# EasyEDA schematic FSPDL_50.5-51Hz.json
TITLE: FSPC for SSR; REV: 1.0; Date: 2021-05-08; Sheet: 1/1; Company: John Matthew Lynch
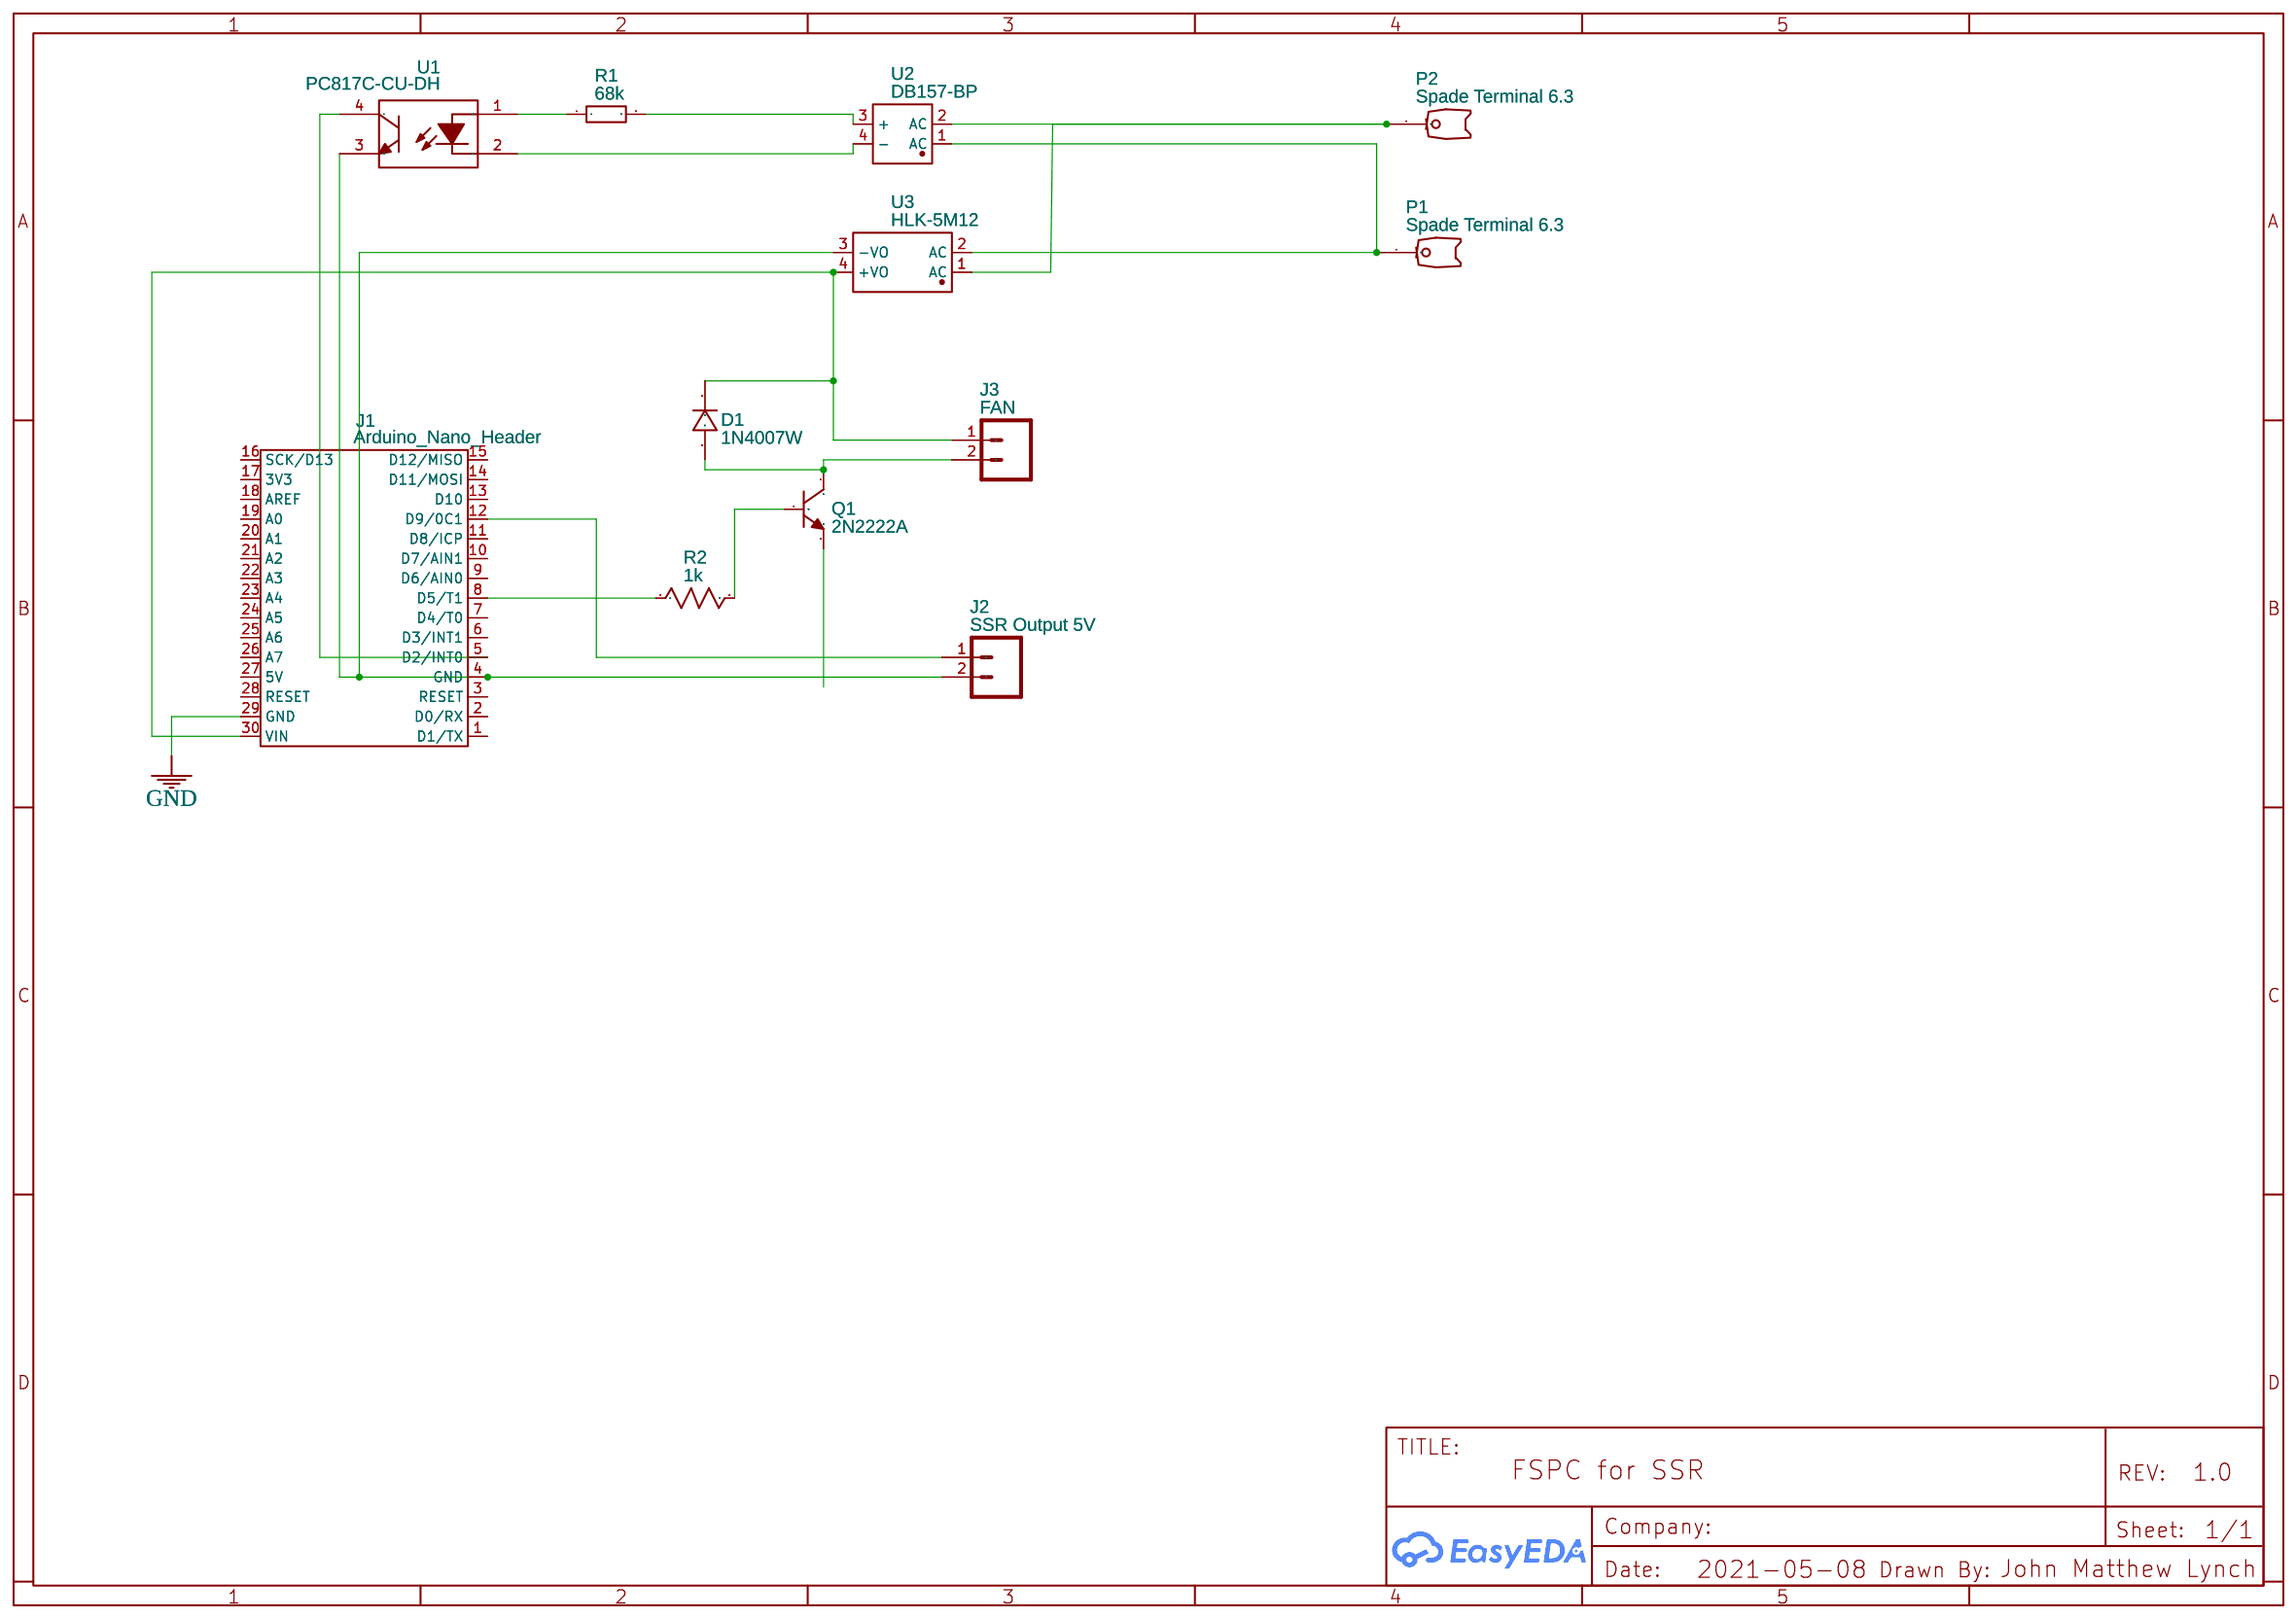
[diagram p0: schematic sheet]

## Parts
D1  1N4007W  [SOD-123_L2.8-W1.8-LS3.7-RD]
J1  Arduino_Nano_Header  [DIP-30_L43.18-W15.24-ARDUINONANO]
J2  SSR Output 5V  [JST-2-PTH]
J3  FAN  [JST-2-PTH]
P1  Spade Terminal 6.3  [CONNECTOR-SPADE-6.3MM]
P2  Spade Terminal 6.3  [CONNECTOR-SPADE-6.3MM]
Q1  2N2222A  [TO-92-3_L4.8-W3.7-P2.54-R]
R1  68k  [1W 68K]
R2  1k  [R0603]
U1  PC817C-CU-DH  [DIP-4_L4.6-W6.5-P2.54-LS7.6-BL]
U2  DB157-BP  [DB_L8.3-W6.4-P5.10-LS7.6]
U3  HLK-5M12  [PWRM-TH_HLK-5M12]

## Library data of the parts
D1 = 1N4007W: Supplier: LCSC; Supplier Part: C328592; Manufacturer: BLUE ROCKET; Contributor: LCEDA_Lib
J1 = Arduino_Nano_Header
J2 J3 = CONN_02JST-PTH-2: Multi connection point. Often used as Generic Header-pin footprint for 0.1 inch spacedstyle header connections
P1 P2 = Spade Terminal 6.3: Manufacturer: Keystone; Manufacturer Part: 1287; Supplier: LCSC; Supplier Part: C238078; link: https://datasheet.lcsc.com/szlcsc/Keystone-1287_C238078.pdf; Contributor: Chillums
Q1 = 2N2222A: Contributor: LCSC; Supplier: LCSC; Supplier Part: C358533; Manufacturer: BLUE ROCKET(蓝箭); JLCPCB Part Class: Extended Part
R1 = 1W 68K: Supplier: LCSC; Supplier Part: C119513; Manufacturer: Chian Chia Elec; Contributor: Alexander K
R2 = R_0603_US: Contributor: LCEDA_Lib
U1 = PC817C-CU-DH: Supplier: LCSC; Supplier Part: C427589; Manufacturer: Nanjing Micro One Elec; Contributor: LCSC
U2 = DB157-BP: Supplier: LCSC; Supplier Part: C2975492; Manufacturer: MCC(美微科); Contributor: LCSC
U3 = HLK-5M12: Supplier: LCSC; Supplier Part: C209908; Manufacturer: HI-LINK; Contributor: LCSC; JLCPCB Part Class: Extended Part

## Nets
GND: J1.29(GND)
Net-(D1-1): D1.1 J1.30(VIN) J3.1 U3.4(+VO)
Net-(D1-2): D1.2 J3.2 Q1.1(C)
Net-(J1-4): J1.4(GND) J2.2 U1.3 U3.3(-VO)
Net-(J1-5): J1.5(D2/INT0) U1.4
Net-(J1-8): J1.8(D5/T1) R2.1
Net-(J1-12): J1.12(D9/0C1) J2.1
Net-(P1-1): P1.1 U2.1(AC) U3.2(AC)
Net-(P2-1): P2.1 U2.2(AC) U3.1(AC)
Net-(Q1-2): Q1.2(B) R2.2
Net-(R1-1): R1.1 U1.1
Net-(R1-2): R1.2 U2.3(+)
Net-(U1-2): U1.2 U2.4(-)

Not connected (* = marked no-connect by the designer): J1 1(D1/TX) 2(D0/RX) 3(RESET) 6(D3/INT1) 7(D4/T0) 9(D6/AIN0) 10(D7/AIN1) 11(D8/ICP) 13(D10) 14(D11/MOSI) 15(D12/MISO) 16(SCK/D13) 17(3V3) 18(AREF) 19(A0) 20(A1) 21(A2) 22(A3) 23(A4) 24(A5) 25(A6) 26(A7) 27(5V) 28(RESET); Q1 3(E)
